# Altium schematic sheet INA381A SEL Protection.SchDoc: LT4363-2 SEL Protection
size Letter; SheetNumber: 13; SheetTotal: 18
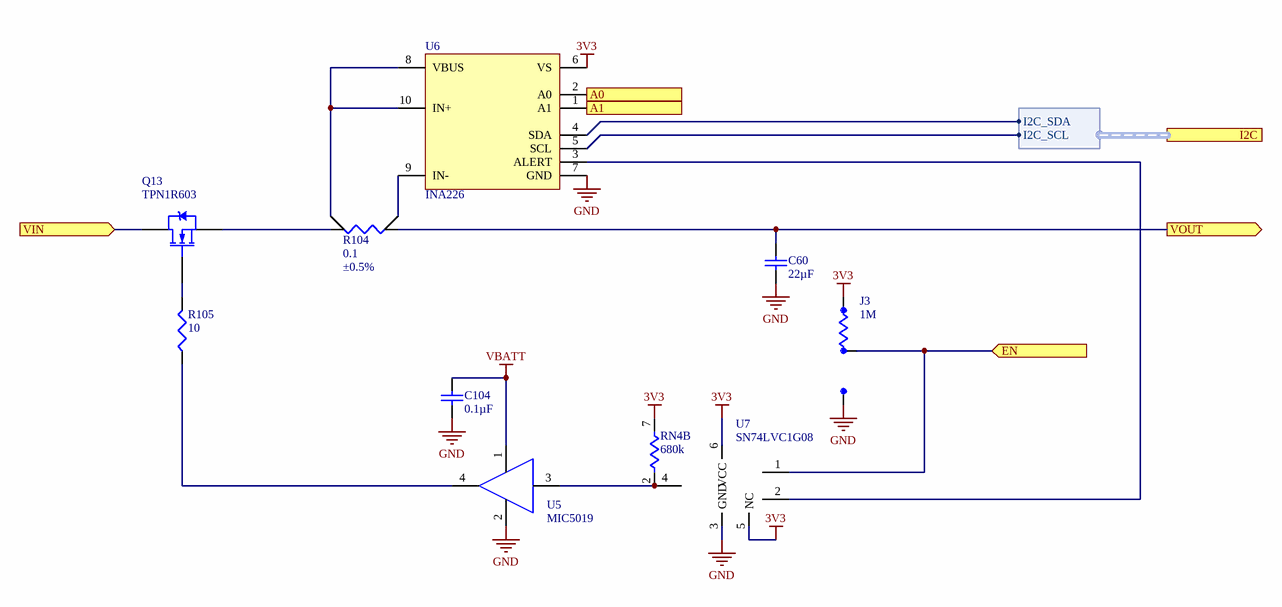
[diagram p0: INA381A SEL Protection.SchDoc]

## Parts
C60  value 22µF  [TY-1206L]  (hidden comment: Cap)
C104  value 0.1µF  [TDK-CGA2B]  (hidden comment: Cap)
J3  value 1M  [PANA-ERJ2R(3-PIN)]  (hidden comment: 3-pin jumper)
Q13  TPN1R603  [TOSH-S-3X1S]
R104  value 0.1  Tolerance: ±0.5%  [VSH-WSL0805]  (hidden comment: Res Sense)
R105  value 10  [PANA-ERA2A]  (hidden comment: Res3)
RN4  value 680k  [PANA-EXB28V]  (hidden comment: Res4 Pack1)  (part B of 4)
U5  MIC5019  [MCP-MIC5019]
U6  INA226  [TI-DGS]
U7  SN74LVC1G08  [TI-DRY0006A]

## Ports
A0 (in), A1 (in), EN (in), I2C (harness INA226_I2C), VIN (in), VOUT (out)

## Harnesses
INA226_I2C: I2C_SCL, I2C_SDA

## Nets
3V3: J3.3 RN4.7 U6.6(VS) U7.5(NC) U7.6(VCC)
GND: C60.1 C104.1 J3.1 U5.2(GND) U6.7(GND) U7.3(GND)
VBATT: C104.2 U5.1(VDD)
A0: U6.2(A0) ; port A0
A1: U6.1(A1) ; port A1
EN: J3.2 U7.1(A) ; port EN
VIN: Q13.2(D) ; port VIN
VOUT: C60.2 R104.2(I2) ; port VOUT
NetQ13_1: Q13.1(G) R105.2
NetQ13_3: Q13.3(S) R104.1(I1)
NetR104_3: R104.3(S2) U6.9(IN-)
NetR104_4: R104.4(S1) U6.8(VBUS) U6.10(IN+)
NetR105_1: R105.1 U5.4(OUT)
NetRN4_2: RN4.2 U5.3(IN) U7.4(Y)
NetU6_3: U6.3(ALERT) U7.2(B)
NetU6_4: U6.4(SDA) ; port I2C.I2C_SDA
NetU6_5: U6.5(SCL) ; port I2C.I2C_SCL

## Notes on the sheet
- (the "License"); you may not use or redistribute this file except in compliance with the License. You
- This file and the information within it are licensed under the terms of the Apache License, Version 2.0
- Copyright
- Unless required by applicable law or agreed to in writing, content distributed under the License is
- distributed on an "AS IS" BASIS, WITHOUT WARRANTIES OR CONDITIONS OF ANY KIND,
- either express or implied. See the License for the specific language governing permissions and
- limitations under the License.
- may obtain a copy of the License at:
- http://www.apache.org/licenses/LICENSE-2.0
- Title
- Size:
- Date:
- Letter
- Number:
- Time:
- Revision:
- Sheet
- of
- University of Alberta
- Deptartment of Electrical
- and Computer Engineering
- Edmonton AB, Canada
- T6G 1H9
- File:

## Library data of the parts
C60 = PC-TY-00721: CAP CER 22UF 16V X7R 1206; Manufacturer Part Number: EMK316BB7226ML-T; Index: 721; Designator: C?; Tolerance: ±20%; Published: 3/13/2016; LatestRevisionDate: 3/13/2016; LatestRevisionNote: ...; PackageReference: 1206 (3216 Metric); Publisher: AlbertaSat; PackageDescription: Chip Capacitor, 2-Leads, Body 3.20x1.60mm, IPC Low Density; Part Number: PC-TY-00721; Supplier Part Number 1: 587-4319-1-ND; Supplier 1: Digi-key; Supplier Link: http://www.digikey.ca/product-search/en?keywords=587-4319-1-ND; Voltage-Rated: 16V; Temperature Coefficient: X7R; Application: General Purpose
C104 = PC-TDK-02259: CAP CER 0.1UF 50V X7R 0402; Manufacturer Part Number: CGA2B3X7R1H104K050BB; Index: 2259; Designator: C?; Tolerance: ±10%; Published: 2016-03-16; LatestRevisionDate: 2016-03-16; LatestRevisionNote: ...; PackageReference: 0402 (1005 Metric); Publisher: AlbertaSat; PackageDescription: Radial Cap, Thru-Hole; 2 Leads; 0.3 in Pin Spacing; Part Number: PC-TDK-02259; Supplier Part Number 1: 445-6899-1-ND; Supplier 1: Digi-key; Supplier Link: http://www.digikey.ca/product-search/en?keywords=445-6899-1-ND; Voltage - Rated: 50V; Temperature Coefficient: X7R; Applications: Automotive
J3 = 20037: RES SMD 1M OHM 1% 1/10W 0402; Part Number: 20037; Manufacturer Part Number: ERJ-2RKF1004X; Designator: R?; Power: 0.1W, 1/10W; Temperature Coefficient: ±100ppm/°C; Supplier Part Number 1: P1.00MLCT-ND; Supplier 1: Digi-Key; Supplier Link: #https://www.digikey.ca/products/en?keywords=P1.00MLCT-ND#; PackageReference: 0402 (1005 Metric); Tolerance: ±1%
Q13 = PU-TOSH-00002: X35 PB-F POWER MOSFET TRANSISTOR; Index: 2; Designator: Q?; Rds On: 1.6mOhm @ 40A, 10V; Part Number: PU-TOSH-00002; Manufacturer Part Number: TPN1R603PL,L1Q; Supplier Part Number 1: TPN1R603PLL1QCT-ND; Supplier 1: Digi-key; Supplier Part Number 2: 757-TPN1R603PLL1Q; Supplier 2: Mouser; Publisher: AlbertaSat; Published: 2020-04-01; LatestRevisionDate: 2020-04-01; LatestRevisionNote: ...; PackageReference: 8-TSON Advance (3.3x3.3); PackageDescription: SON, 8-Leads, Body 3.10x3.10mm, Pitch 0.65mm, Thermal Pad 2.49x2.06mm, IPC Low Density; Supplier Link: #https://www.digikey.ca/product-detail/en/toshiba-semiconductor-and-storage/TPN1R603PL-L1Q/TPN1R603PLL1QCT-ND/6570930#
R104 = PR-VSH-00315: RES 0.1 OHM 0.5% 1/4W 0805; Manufacturer Part Number: WSL0805R1000DEA18-ND; Power - Rated: 0.25W, 1/4W; Index: 315; Designator: R?; Temperature Coefficient: ±75ppm/°C; Part Number: PR-VSH-00315; Supplier Part Number 1: WSL0805R1000DEA18-ND; Supplier 1: Digi-key; Publisher: AlbertaSat; Published: 2019-08-08; LatestRevisionDate: 2019-08-08; LatestRevisionNote: ...; PackageReference: 0805 (2012 Metric); PackageDescription: 0805 (2012 Metric); Supplier Link: #https://www.digikey.ca/products/en?keywords=WSL0805R1000DEA18-ND#
R105 = 13235: RES SMD 10 OHM 0.5% 1/16W 0402; Part Number: 13235; Manufacturer Part Number: ERA-2AKD100X; Designator: R?; Power: 0.063W, 1/16W; Temperature Coefficient: ±100ppm/°C; Published: 8-Jun-2000; LatestRevisionDate: 29-May-2009; LatestRevisionNote: IPC-7351 Footprint Added.; PackageReference: 0402 (1005 Metric); Publisher: Altium Limited; PackageDescription: Chip Resistor, 2-Leads, Body 1.00x0.50mm, IPC Low Density; Supplier Part Number 1: P10DDCT-ND; Supplier 1: Digi-Key; Supplier Link: http://www.digikey.ca/product-search/en?keywords=P10DDCT-ND; Tolerance: ±0.5%
RN4 = 20005: RES ARRAY 4 RES 680K OHM 0804; Part Number: 20005; Manufacturer Part Number: EXB-28V684JX; Sim Note: Enter the Resistance value into parameter field.; Designator: RN?; Tolerance: ±5%; Power: 62.5mW; Temperature Coefficient: ±200ppm/°C; Code_JEDEC: MS-012-AC; Supplier Part Number 1: Y7684CT-ND; Supplier 1: Digi-Key; Supplier Link: http://www.digikey.ca/product-search/en?keywords=Y7684CT-ND; PackageReference: 0804, Convex, Long Side Terminals
U5 = PU-MCP-00000: IC GATE DRVR HIGH-SIDE 4TQFN; Index: 8; Designator: U?; Part Number: PU-MCP-00000; Manufacturer Part Number: MIC5019YFT-TR; Supplier Part Number 1: 576-4152-1-ND; Supplier 1: Digi-key; Supplier Part Number 2: 998-MIC5019YFTTR; Supplier 2: Mouser; Publisher: AlbertaSat; Published: 2020-04-01; LatestRevisionDate: 2020-04-01; LatestRevisionNote: ...; PackageReference: 4-TQFN (1.2x1.2); Supplier Link: #https://www.digikey.ca/en/products/detail/microchip-technology/MIC5019YFT-TR/3681038#; Operating Temperature: -40°C ~ 125°C (TJ)
U6 = 19: IC MONITOR PWR/CURR BIDIR 10MSOP; Part Number: 19; Manufacturer Part Number: INA226AQDGSRQ1; Designator: U?; Supplier Part Number 2: 595-INA226AQDGSRQ1; Supplier 2: Mouser; Supplier Part Number 1: 296-42503-1-ND; Supplier 1: Digi-Key; Supplier Link: https://www.digikey.com/product-detail/en/texas-instruments/INA226AQDGSRQ1/296-42503-1-ND/5416001; PackageReference: TI-MSOP10
U7 = 112: AND Gate IC 1 Channel  6-USON (1.45x1); Part Number: 112; Manufacturer Part Number: SN74LVC1G08QDRYRQ1; Supplier Part Number 2: 595-74LVC1G08QDRYRQ1; Supplier 2: Mouser; Supplier Part Number 1: 296-SN74LVC1G08QDRYRQ1CT-ND; Supplier 1: Digi-Key; Supplier Link: #https://www.digikey.ca/product-detail/en/texas-instruments/SN74LVC1G08QDRYRQ1/296-SN74LVC1G08QDRYRQ1CT-ND/10715913#; PackageReference: 6-USON (1.45x1); Operating Temperature: -40°C ~ 125°C